# Altium schematic sheet Test.SchDoc
size A2; PageSetup: Record=PageOptions|CenterHorizontal=True|CenterVertical=True|PrintScale=0.68|XCorrection=1.00|YCorrection=1.00|PrintKind=1|BorderSize=5000000|LeftOffset=0|BottomOffset=0|Orientation=2|PaperLength=1000|PaperWidth=1000|Scale=100|PaperSource=7|PrintQuality=-4|MediaType=1|DitherType=10|PrintScaleMode=1|PaperKind=A3
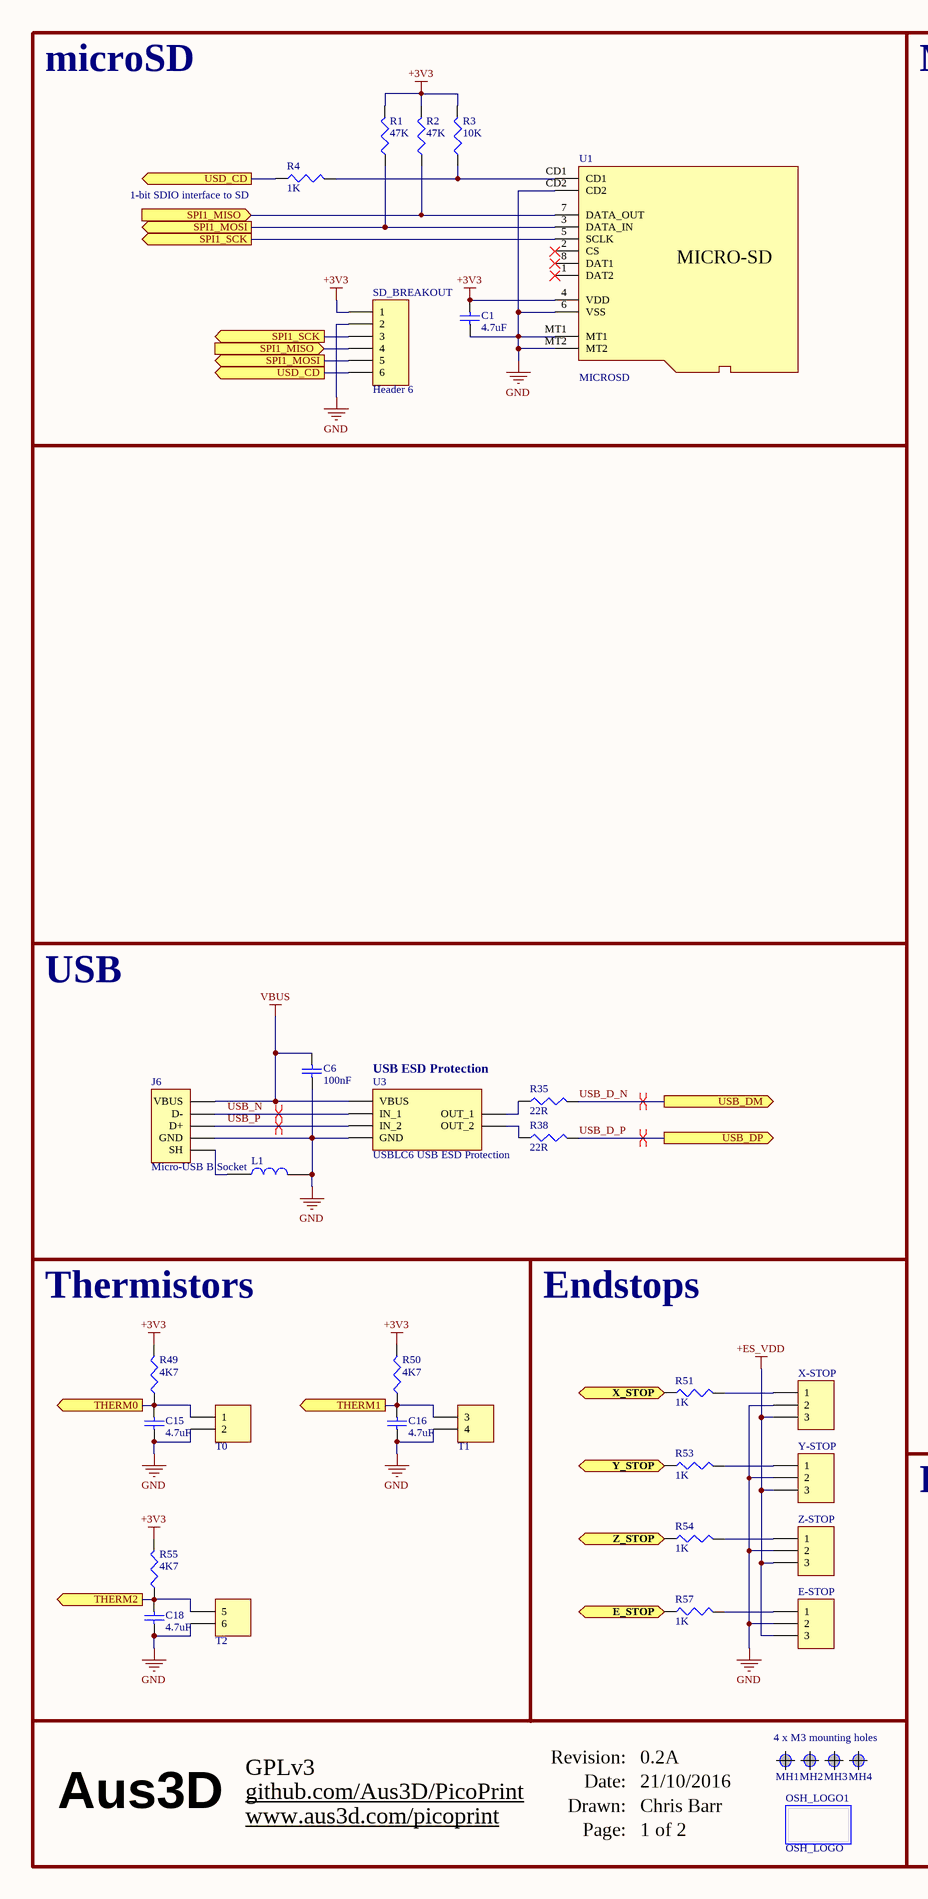
[diagram p0: Test.SchDoc, left]
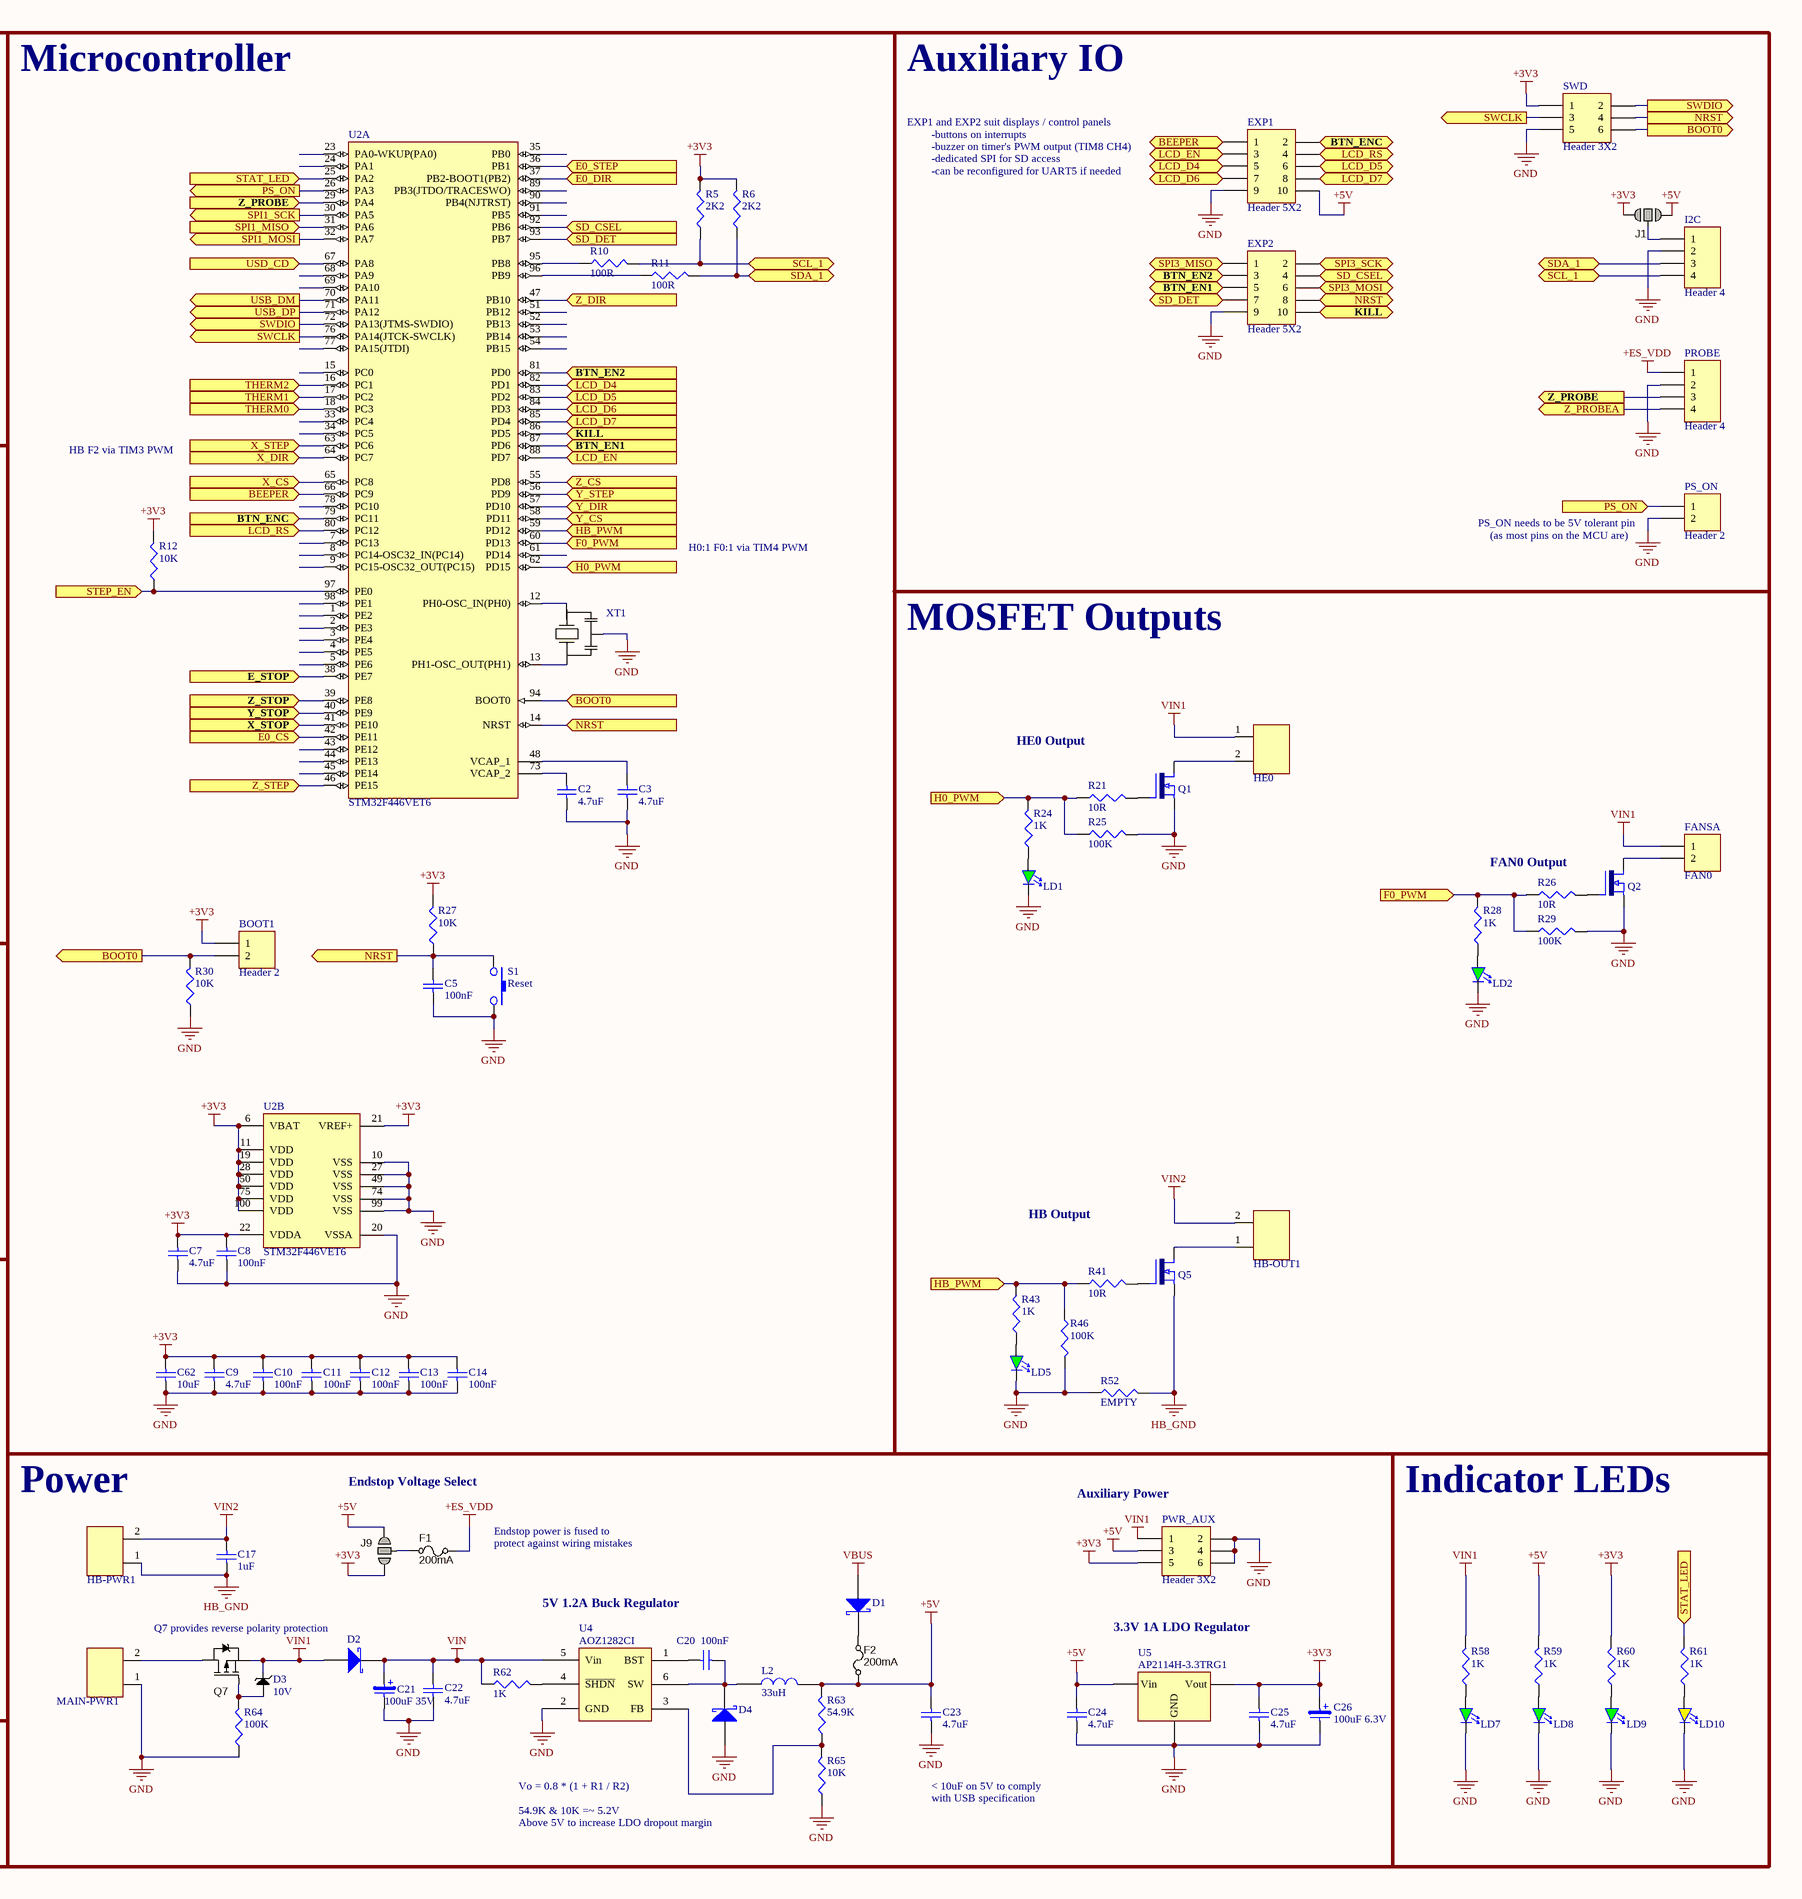
[diagram p1: Test.SchDoc, right]

## Parts
BOOT1  Header 2  [HDR1X2-HEADER]
C1  value 4.7uF  [CAP 1005-0402]  (hidden comment: CapC-0402-4.7uF-10V)
C2  value 4.7uF  [CAP 1005-0402]  (hidden comment: CapC-0402-4.7uF-10V)
C3  value 4.7uF  [CAP 1005-0402]  (hidden comment: CapC-0402-4.7uF-10V)
C5  value 100nF  [CAP 1005-0402]  (hidden comment: CapC-0402-100nF)
C6  value 100nF  [CAP 1005-0402]  (hidden comment: CapC-0402-100nF)
C7  value 4.7uF  [CAP 1005-0402]  (hidden comment: CapC-0402-4.7uF-10V)
C8  value 100nF  [CAP 1005-0402]  (hidden comment: CapC-0402-100nF)
C9  value 4.7uF  [CAP 1005-0402]  (hidden comment: CapC-0402-4.7uF-10V)
C10  value 100nF  [CAP 1005-0402]  (hidden comment: CapC-0402-100nF)
C11  value 100nF  [CAP 1005-0402]  (hidden comment: CapC-0402-100nF)
C12  value 100nF  [CAP 1005-0402]  (hidden comment: CapC-0402-100nF)
C13  value 100nF  [CAP 1005-0402]  (hidden comment: CapC-0402-100nF)
C14  value 100nF  [CAP 1005-0402]  (hidden comment: CapC-0402-100nF)
C15  value 4.7uF  [CAP 1005-0402]  (hidden comment: CapC-0402-4.7uF-10V)
C16  value 4.7uF  [CAP 1005-0402]  (hidden comment: CapC-0402-4.7uF-10V)
C17  value 1uF  [Cap 1608-0603]  (hidden comment: CapC-0603-1uF 50V)
C18  value 4.7uF  [CAP 1005-0402]  (hidden comment: CapC-0402-4.7uF-10V)
C20  value 100nF  [CAP 1005-0402]  (hidden comment: CapC-0402-100nF)
C21  value 100uF 35V  [CAP EL PANASONIC]  (hidden comment: CapE-6.3-100uF-35V)
C22  value 4.7uF  [CAP 3225-1210]  (hidden comment: CapC-1210-4.7uF-50V)
C23  value 4.7uF  [CAPC2012X135N]  (hidden comment: CapC-0805-4.7uF 10V)
C24  value 4.7uF  [CAPC2012X135N]  (hidden comment: CapC-0805-4.7uF 10V)
C25  value 4.7uF  [CAP 1005-0402]  (hidden comment: CapC-0402-4.7uF-10V)
C26  value 100uF 6.3V  [CAP EL 5mm]  (hidden comment: CapE-5.0-100uF-6.3V)
C62  value 10uF  [CAPC2012X135N]  (hidden comment: CapC-0805-10uF 6.3V)
D1  Diode Schottky 700mA 20V  [SC-85]  (value not drawn)
D2  Diode Schottky 2A 40V  [DIOM2616X08N]  (value not drawn)
D3  Voltage: 10V  [SOD523]  (hidden comment: Diode Zener 10V)
D4  Diode Schottky 2A 40V  [DIOM2616X08N]  (value not drawn)
E-STOP  Header 3  [HDR1X3-HEADER]  (value not drawn)
EXP1  Header 5X2  [HDR2X5_exp Iner only\]
EXP2  Header 5X2  [HDR2X5_exp Iner only\]
F1  value 200mA  [PTC Fuse1608-0603]  (hidden comment: PTC Resettable Fuse)
F2  value 200mA  [PTC Fuse1608-0603]  (hidden comment: PTC Resettable Fuse)
FANS  FAN0  [HDR2X3-Header]  (part A of 3)
HB-OUT1  Screw Terminal 5mm 2-Way  [TERM2 5MM]  (value not drawn)
HB-PWR1  Screw Terminal 5mm 2-Way  [TERM2 5MM]  (value not drawn)
HE0  Screw Terminal 3.5mm 2-Way  [TERM2 3.5mm]  (value not drawn)
I2C  Header 4  [HDR1X4-HEADER]
J1  Jumper  [JUMPER-3-NO]  (value not drawn)  (no BOM)
J6  Micro-USB B Socket  [Micro-USB B Molex 105017-0001]
J9  Jumper  [JUMPER-3-NO]  (value not drawn)  (no BOM)
L1  Ferrite Bead SMD 0805  [Res 2012-0805]  (value not drawn)
L2  value 33uH  [SRN6045TA SMD Inductor]  (hidden comment: Inductor SMD 33uH 2.5A)
LD1  GREEN  [LED 1608-0603]  (value not drawn)
LD2  GREEN  [LED 1608-0603]  (value not drawn)
LD5  GREEN  [LED 1608-0603]  (value not drawn)
LD7  GREEN  [LED 1608-0603]  (value not drawn)
LD8  GREEN  [LED 1608-0603]  (value not drawn)
LD9  GREEN  [LED 1608-0603]  (value not drawn)
LD10  YELLOW  [LED 1608-0603]  (value not drawn)
MAIN-PWR1  Screw Terminal 5mm 2-Way  [TERM2 5MM]  (value not drawn)
MH1  Screw Hole  [M3-Hole-2]  (value not drawn)  (no BOM)
MH2  Screw Hole  [M3-Hole-2]  (value not drawn)  (no BOM)
MH3  Screw Hole  [M3-Hole-2]  (value not drawn)  (no BOM)
MH4  Screw Hole  [M3-Hole-2]  (value not drawn)  (no BOM)
OSH_LOGO1  OSH_LOGO  [OSHW-LOGO-L]  (no BOM)
PROBE  Header 4  [HDR1X4-HEADER]
PS_ON  Header 2  [HDR1X2-HEADER]
PWR_AUX  Header 3X2  [HDR2X3-Header]
Q1  MOSFET - AO3400A  [SOT23-3 New]  (value not drawn)
Q2  MOSFET - AO3400A  [SOT23-3 New]  (value not drawn)
Q5  PSMN1R8-40YLC  [LFPACK]  (value not drawn)
Q7  SIA453EDJ-T1-GE3  [PowerPAK SC-70]  (value not drawn)
R1  value 47K  [RESC1005X40N]  (hidden comment: Res-0402-47K)
R2  value 47K  [RESC1005X40N]  (hidden comment: Res-0402-47K)
R3  value 10K  [RESC1005X40N]  (hidden comment: Res-0402-10K)
R4  value 1K  [RESC1005X40N]  (hidden comment: Res-0402-1K)
R5  value 2K2  [RESC1005X40N]  (hidden comment: Res-0402-2K2)
R6  value 2K2  [RESC1005X40N]  (hidden comment: Res-0402-2K2)
R10  value 100R  [RESC1005X40N]  (hidden comment: Res-0402-100R)
R11  value 100R  [RESC1005X40N]  (hidden comment: Res-0402-100R)
R12  value 10K  [RESC1005X40N]  (hidden comment: Res-0402-10K)
R21  value 10R  [RESC1005X40N]  (hidden comment: Res-0402-10R)
R24  value 1K  [RESC1005X40N]  (hidden comment: Res-0402-1K)
R25  value 100K  [RESC1005X40N]  (hidden comment: Res-0402-100K)
R26  value 10R  [RESC1005X40N]  (hidden comment: Res-0402-10R)
R27  value 10K  [RESC1005X40N]  (hidden comment: Res-0402-10K)
R28  value 1K  [RESC1005X40N]  (hidden comment: Res-0402-1K)
R29  value 100K  [RESC1005X40N]  (hidden comment: Res-0402-100K)
R30  value 10K  [RESC1005X40N]  (hidden comment: Res-0402-10K)
R35  value 22R  [RESC1005X40N]  (hidden comment: Res-0402-22R)
R38  value 22R  [RESC1005X40N]  (hidden comment: Res-0402-22R)
R41  value 10R  [RESC1005X40N]  (hidden comment: Res-0402-10R)
R43  value 1K  [RESC1005X40N]  (hidden comment: Res-0402-1K)
R46  value 100K  [RESC1005X40N]  (hidden comment: Res-0402-100K)
R49  value 4K7  [RESC1005X40N]  (hidden comment: Res-0402-4K7)
R50  value 4K7  [RESC1005X40N]  (hidden comment: Res-0402-4K7)
R51  value 1K  [RESC1005X40N]  (hidden comment: Res-0402-1K)
R52  value EMPTY  [RESC1005X40N]  (hidden comment: Res-0402-EMPTY)  (no BOM)
R53  value 1K  [RESC1005X40N]  (hidden comment: Res-0402-1K)
R54  value 1K  [RESC1005X40N]  (hidden comment: Res-0402-1K)
R55  value 4K7  [RESC1005X40N]  (hidden comment: Res-0402-4K7)
R57  value 1K  [RESC1005X40N]  (hidden comment: Res-0402-1K)
R58  value 1K  [RESC1005X40N]  (hidden comment: Res-0402-1K)
R59  value 1K  [RESC1005X40N]  (hidden comment: Res-0402-1K)
R60  value 1K  [RESC1005X40N]  (hidden comment: Res-0402-1K)
R61  value 1K  [RESC1005X40N]  (hidden comment: Res-0402-1K)
R62  value 1K  [RESC1005X40N]  (hidden comment: Res-0402-1K)
R63  value 54.9K  [RESC1005X40N]  (hidden comment: Res-0402-54.9K)
R64  value 100K  [RESC1005X40N]  (hidden comment: Res-0402-100K)
R65  value 10K  [RESC1005X40N]  (hidden comment: Res-0402-10K)
S1  Reset  [SW-PB SMD 2pin]
SD_BREAKOUT  Header 6  [HDR1X6-HEADER]
SWD  Header 3X2  [HDR2X3-Header]
THERM_HEADER  T0  [HDR1X8-HEADER]  (parts A,B,C of 4)
U1  MICROSD  [MICRO-SD]
U2  STM32F446VET6  [STM-LQFP100_N]  (parts A,B of 2)
U3  USBLC6 USB ESD Protection  [SOT23-6N]
U4  AOZ1282CI  [SOT23-6N]
U5  AP2114H-3.3TRG1  [SOT229P700X180-4N]
X-STOP  Header 3  [HDR1X3-HEADER]  (value not drawn)
XT1  Ceramic Resonator CSTCE12M0G55-R0  [CERALOCK CSTCE_G]  (value not drawn)
Y-STOP  Header 3  [HDR1X3-HEADER]  (value not drawn)
Z-STOP  Header 3  [HDR1X3-HEADER]  (value not drawn)

## Blocks framed on the sheet
microSD: C1 R1-R4 SD_BREAKOUT U1
Microcontroller: BOOT1 C2 C3 C5 C7-C14 C62 R5 R6 R10-R12 R27 R30 S1 U2 XT1
Auxiliary IO: EXP1 EXP2 I2C J1 PROBE PS_ON SWD
MOSFET Outputs: FANS HB-OUT1 HE0 LD1 LD2 LD5 Q1 Q2 Q5 R21 R24-R26 R28 R29 R41 R43 R46 R52
USB: C6 J6 L1 R35 R38 U3
Thermistors: C15 C16 C18 R49 R50 R55 THERM_HEADER
Endstops: E-STOP R51 R53 R54 R57 X-STOP Y-STOP Z-STOP
Power: C17 C20-C26 D1-D4 F1 F2 HB-PWR1 J9 L2 MAIN-PWR1 PWR_AUX Q7 R62-R65 U4 U5
Indicator LEDs: LD7-LD10 R58-R61
Aus3D: MH1-MH4 OSH_LOGO1

## Ports
BEEPER (in), BOOT0 (in), BOOT0 (out), BTN_EN1 (in), BTN_EN1 (out), BTN_EN2 (in), BTN_EN2 (out), BTN_ENC (in), BTN_ENC (out), E0_CS (in), E0_DIR (in), E0_STEP (in), E_STOP (in), E_STOP (out), F0_PWM (in), H0_PWM (in), HB_PWM (in), KILL (in), KILL (out), LCD_D4 (in), LCD_D5 (in), LCD_D6 (in), LCD_D7 (in), LCD_EN (in), LCD_RS (in), NRST (in), NRST (out), PS_ON (in), PS_ON (out), SCL_1 (bidir), SD_CSEL (in), SD_DET (in), SD_DET (out), SDA_1 (bidir), SPI1_MISO (in), SPI1_MOSI (out), SPI1_SCK (out), SPI3_MISO (in), SPI3_MOSI (in), SPI3_SCK (in), STAT_LED (in), STEP_EN (in), SWCLK (out), SWDIO (out), THERM0 (in), THERM0 (out), THERM1 (in), THERM1 (out), THERM2 (in), THERM2 (out), USB_DM (out), USB_DP (out), USD_CD (in), USD_CD (out), X_CS (in), X_DIR (in), X_STEP (in), X_STOP (in), X_STOP (out), Y_CS (in), Y_DIR (in), Y_STEP (in), Y_STOP (in), Y_STOP (out), Z_CS (in), Z_DIR (in), Z_PROBE (in), Z_PROBE (out), Z_PROBEA (out), Z_STEP (in), Z_STOP (in), Z_STOP (out)

## Nets
+3V3: BOOT1.1 C1.2 C7.2 C8.2 C9.2 C10.2 C11.2 C12.2 C13.2 C14.2 C25.2 C26.1 C62.2 J1.1 J9.1 PWR_AUX.5 R1.2 R2.2 R3.2 R5.2 R6.2 R12.2 R27.2 R49.2 R50.2 R55.2 R60.2 SD_BREAKOUT.1 SWD.1 U1.4(VDD) U2.6(VBAT) U2.11(VDD) U2.19(VDD) U2.21(VREF+) U2.22(VDDA) U2.28(VDD) U2.50(VDD) U2.75(VDD) U2.100(VDD) U5.Vout
+5V: C23.2 C24.2 EXP1.10 F2.1 J1.3 J9.3 L2.2 PWR_AUX.3 R59.2 R63.2 U5.Vin
+ES_VDD: E-STOP.3 F1.2 PROBE.1 X-STOP.3 Y-STOP.3 Z-STOP.3
GND: C1.1 C2.1 C3.1 C5.1 C6.1 C7.1 C8.1 C9.1 C10.1 C11.1 C12.1 C13.1 C14.1 C15.1 C16.1 C18.1 C21.2 C22.1 C23.1 C24.1 C25.1 C26.2 C62.1 D4.A E-STOP.2 EXP1.9 EXP2.9 I2C.2 J6.GND L1.2 LD1.2(K) LD2.2(K) LD5.2(K) LD7.2(K) LD8.2(K) LD9.2(K) LD10.2(K) MAIN-PWR1.1 PROBE.2 PS_ON.2 PWR_AUX.2 PWR_AUX.4 PWR_AUX.6 Q1.2(S) Q2.2(S) R25.2 R29.2 R30.1 R46.2 R52.1 R64.1 R65.1 S1.2 SD_BREAKOUT.2 SWD.5 THERM_HEADER.2 THERM_HEADER.4 THERM_HEADER.6 U1.6(VSS) U1.CD2 U1.MT1 U1.MT2 U2.10(VSS) U2.20(VSSA) U2.27(VSS) U2.49(VSS) U2.74(VSS) U2.99(VSS) U3.2(GND) U4.2(GND) U5.GND X-STOP.2 XT1.2(GND) Y-STOP.2 Z-STOP.2
HB_GND: C17.1 HB-PWR1.1 Q5.3(S) R52.2
VBUS: C6.2 D1.1(A) J6.VBUS U3.5(VBUS)
VIN: C21.1 C22.2 D2.K R62.1 U4.5(Vin)
VIN1: D2.A D3.K FANS.1 HE0.1 PWR_AUX.1 Q7.4(S) R58.2
VIN2: C17.2 HB-OUT1.2 HB-PWR1.2
BEEPER: EXP1.1 U2.66(PC9) ; port BEEPER
BOOT0: BOOT1.2 R30.2 SWD.6 U2.94(BOOT0) ; port BOOT0
BTN_EN1: EXP2.5 U2.87(PD6) ; port BTN_EN1
BTN_EN2: EXP2.3 U2.81(PD0) ; port BTN_EN2
BTN_ENC: EXP1.2 U2.79(PC11) ; port BTN_ENC
E0_CS: U2.42(PE11) ; port E0_CS
E0_DIR: U2.37(PB2-BOOT1(PB2)) ; port E0_DIR
E0_STEP: U2.36(PB1) ; port E0_STEP
E_STOP: R57.1 U2.38(PE7) ; port E_STOP
F0_PWM: R26.1 R28.2 R29.1 U2.60(PD13) ; port F0_PWM
H0_PWM: R21.1 R24.2 R25.1 U2.62(PD15) ; port H0_PWM
HB_PWM: R41.1 R43.2 R46.1 U2.59(PD12) ; port HB_PWM
KILL: EXP2.10 U2.86(PD5) ; port KILL
LCD_D4: EXP1.5 U2.82(PD1) ; port LCD_D4
LCD_D5: EXP1.6 U2.83(PD2) ; port LCD_D5
LCD_D6: EXP1.7 U2.84(PD3) ; port LCD_D6
LCD_D7: EXP1.8 U2.85(PD4) ; port LCD_D7
LCD_EN: EXP1.3 U2.88(PD7) ; port LCD_EN
LCD_RS: EXP1.4 U2.80(PC12) ; port LCD_RS
NRST: C5.2 EXP2.8 R27.1 S1.1 SWD.4 U2.14(NRST) ; port NRST
PS_ON: PS_ON.1 U2.26(PA3) ; port PS_ON
SCL_1: I2C.4 R5.1 R10.2 ; port SCL_1
SD_CSEL: EXP2.4 U2.92(PB6) ; port SD_CSEL
SD_DET: EXP2.7 U2.93(PB7) ; port SD_DET
SDA_1: I2C.3 R6.1 R11.2 ; port SDA_1
SPI1_MISO: R2.1 SD_BREAKOUT.4 U1.7(DATA_OUT) U2.31(PA6) ; port SPI1_MISO
SPI1_MOSI: R1.1 SD_BREAKOUT.5 U1.3(DATA_IN) U2.32(PA7) ; port SPI1_MOSI
SPI1_SCK: SD_BREAKOUT.3 U1.5(SCLK) U2.30(PA5) ; port SPI1_SCK
SPI3_MISO: EXP2.1 ; port SPI3_MISO
SPI3_MOSI: EXP2.6 ; port SPI3_MOSI
SPI3_SCK: EXP2.2 ; port SPI3_SCK
STAT_LED: R61.2 U2.25(PA2) ; port STAT_LED
STEP_EN: R12.1 U2.97(PE0) ; port STEP_EN
SWCLK: SWD.3 U2.76(PA14(JTCK-SWCLK)) ; port SWCLK
SWDIO: SWD.2 U2.72(PA13(JTMS-SWDIO)) ; port SWDIO
THERM0: C15.2 R49.1 THERM_HEADER.1 U2.18(PC3) ; port THERM0
THERM1: C16.2 R50.1 THERM_HEADER.3 U2.17(PC2) ; port THERM1
THERM2: C18.2 R55.1 THERM_HEADER.5 U2.16(PC1) ; port THERM2
USB_D_N: R35.2 U2.70(PA11) ; port USB_DM
USB_D_P: R38.2 U2.71(PA12) ; port USB_DP
USB_N: J6.D- U3.1(IN_1)
USB_P: J6.D+ U3.3(IN_2)
USD_CD: R4.1 SD_BREAKOUT.6 U2.67(PA8) ; port USD_CD
X_CS: U2.65(PC8) ; port X_CS
X_DIR: U2.64(PC7) ; port X_DIR
X_STEP: U2.63(PC6) ; port X_STEP
X_STOP: R51.1 U2.41(PE10) ; port X_STOP
Y_CS: U2.58(PD11) ; port Y_CS
Y_DIR: U2.57(PD10) ; port Y_DIR
Y_STEP: U2.56(PD9) ; port Y_STEP
Y_STOP: R53.1 U2.40(PE9) ; port Y_STOP
Z_CS: U2.55(PD8) ; port Z_CS
Z_DIR: U2.47(PB10) ; port Z_DIR
Z_PROBE: PROBE.3 U2.29(PA4) ; port Z_PROBE
Z_PROBEA: PROBE.4 ; port Z_PROBEA
Z_STEP: U2.46(PE15) ; port Z_STEP
Z_STOP: R54.1 U2.39(PE8) ; port Z_STOP
NetC2_2: C2.2 U2.73(VCAP_2)
NetC3_2: C3.2 U2.48(VCAP_1)
NetC20_1: C20.1 D4.K L2.1 U4.6(SW)
NetC20_2: C20.2 U4.1(BST)
NetD1_3: D1.3(K) F2.2
NetD3_A: D3.A Q7.3(G) R64.2
NetE-STOP_1: E-STOP.1 R57.2
NetF1_1: F1.1 J9.2
NetFANS_2: FANS.2 Q2.3(D)
NetHB-OUT1_1: HB-OUT1.1 Q5.2(D)
NetHE0_2: HE0.2 Q1.3(D)
NetI2C_1: I2C.1 J1.2
NetJ6_SHIELD: J6.SHIELD(SH) L1.1
NetLD1_1: LD1.1(A) R24.1
NetLD2_1: LD2.1(A) R28.1
NetLD5_1: LD5.1(A) R43.1
NetLD7_1: LD7.1(A) R58.1
NetLD8_1: LD8.1(A) R59.1
NetLD9_1: LD9.1(A) R60.1
NetLD10_1: LD10.1(A) R61.1
NetMAIN-PWR1_2: MAIN-PWR1.2 Q7.1(D)
NetQ1_1: Q1.1(G) R21.2
NetQ2_1: Q2.1(G) R26.2
NetQ5_1: Q5.1(G) R41.2
NetR3_1: R3.1 R4.2 U1.CD1
NetR10_1: R10.1 U2.95(PB8)
NetR11_1: R11.1 U2.96(PB9)
NetR35_1: R35.1 U3.6(OUT_1)
NetR38_1: R38.1 U3.4(OUT_2)
NetR51_2: R51.2 X-STOP.1
NetR53_2: R53.2 Y-STOP.1
NetR54_2: R54.2 Z-STOP.1
NetR62_2: R62.2 U4.4(~{SHDN})
NetR63_1: R63.1 R65.2 U4.3(FB)
NetU2_12: U2.12(PH0-OSC_IN(PH0)) XT1.3(OUT)
NetU2_13: U2.13(PH1-OSC_OUT(PH1)) XT1.1(IN)

Not connected (* = marked no-connect by the designer): MH1 M3(0); MH2 M3(0); MH3 M3(0); MH4 M3(0); U1 1(DAT2)* 2(CS)* 8(DAT1)*; U2 1(PE2) 2(PE3) 3(PE4) 4(PE5) 5(PE6) 7(PC13) 8(PC14-OSC32_IN(PC14)) 9(PC15-OSC32_OUT(PC15)) 15(PC0) 23(PA0-WKUP(PA0)) 24(PA1) 33(PC4) 34(PC5) 35(PB0) 43(PE12) 44(PE13) 45(PE14) 51(PB12) 52(PB13) 53(PB14) 54(PB15) 61(PD14) 68(PA9) 69(PA10) 77(PA15(JTDI)) 78(PC10) 89(PB3(JTDO/TRACESWO)) 90(PB4(NJTRST)) 91(PB5) 98(PE1)

## Layout directives
differential pair: USB_D_N, USB_D_P, USB_N, USB_P

## Notes on the sheet
- EXP1 and EXP2 suit displays / control panels
- -buttons on interrupts
- -buzzer on timer's PWM output (TIM8 CH4)
- -dedicated SPI for SD access
- (near R4) 1-bit SDIO interface to SD
- -can be reconfigured for UART5 if needed
- HB F2 via TIM3 PWM
- (near PS_ON) PS_ON needs to be 5V tolerant pin
- H0:1 F0:1 via TIM4 PWM
- (near PS_ON) (as most pins on the MCU are)
- HE0 Output
- FAN0 Output
- (near U3) USB ESD Protection
- HB Output
- Endstop Voltage Select
- (near PWR_AUX) Auxiliary Power
- (near F1) Endstop power is fused to
- (near F1) protect against wiring mistakes
- 5V 1.2A Buck Regulator
- Q7 provides reverse polarity protection
- 3.3V 1A LDO Regulator
- 4 x M3 mounting holes
- github.com/Aus3D/PicoPrint
- GPLv3
- Date:
- Revision:
- 0.2A
- 21/10/2016
- Vo = 0.8 * (1 + R1 / R2)
- < 10uF on 5V to comply
- with USB specification
- www.aus3d.com/picoprint
- Drawn:
- Page:
- Chris Barr
- 1 of 2
- 54.9K & 10K =~ 5.2V
- Above 5V to increase LDO dropout margin
- (in symbol MICROSD) MICRO-SD

## Library data of the parts
BOOT1 PS_ON = Header 2: Header, 2-Pin; Note: Approved sub OK; LatestRevisionDate: 17-Jul-2002; LatestRevisionNote: Re-released for DXP Platform.; Publisher: Altium Limited; Supplier 1: Digi-Key; Supplier Part Number 1: 3M9447-ND
C1-C3 C7 C9 C15 C16 C18 C25 = CapC-0402-4.7uF-10V: Capacitor (Semiconductor SIM Model); Voltage: 10V; Note: Approved sub OK; Published: 8-Jun-2000; Revision: July-2002: Re-released for DXP Platform.; Publisher: Altium Limited; Supplier 1: Digi-Key; Supplier Part Number 1: 1276-1482-1-ND
C5 C6 C8 C10-C14 C20 = CapC-0402-100nF: Capacitor (Semiconductor SIM Model); Note: Approved sub OK; Published: 8-Jun-2000; Revision: July-2002: Re-released for DXP Platform.; Publisher: Altium Limited; Supplier 1: Digi-Key; Supplier Part Number 1: 311-1336-1-ND
C17 = CapC-0603-1uF 50V: Capacitor (Semiconductor SIM Model); Note: Approved sub OK; Published: 8-Jun-2000; Revision: July-2002: Re-released for DXP Platform.; Publisher: Altium Limited; Supplier 1: Digi-Key; Supplier Part Number 1: 1276-1860-1-ND
C21 = CapE-6.3-100uF-35V: Polarized Capacitor (Surface Mount); Note: Approved sub OK; Published: 8-Jun-2000; Revision: July-2002: Re-released for DXP Platform.; Publisher: Altium Limited; Supplier 1: Digi-Key; Supplier Part Number 1: PCE5016CT-ND
C22 = CapC-1210-4.7uF-50V: Capacitor (Semiconductor SIM Model); Note: Approved sub OK; Published: 8-Jun-2000; Revision: July-2002: Re-released for DXP Platform.; Publisher: Altium Limited; Supplier 1: Digi-Key; Supplier Part Number 1: 490-1864-1-ND
C23 C24 = CapC-0805-4.7uF 10V: Capacitor (Semiconductor SIM Model); Note: Approved sub OK; Published: 8-Jun-2000; Revision: July-2002: Re-released for DXP Platform.; Publisher: Altium Limited; Supplier 1: Digi-Key; Supplier Part Number 1: 1276-1244-1-ND
C26 = CapE-5.0-100uF-6.3V: Polarized Capacitor (Surface Mount); Note: Approved sub OK; Published: 8-Jun-2000; Revision: July-2002: Re-released for DXP Platform.; Publisher: Altium Limited; Supplier 1: Digi-Key; Supplier Part Number 1: 565-2057-1-ND
C62 = CapC-0805-10uF 6.3V: Capacitor (Semiconductor SIM Model); Note: Approved sub OK; Published: 8-Jun-2000; Revision: July-2002: Re-released for DXP Platform.; Publisher: Altium Limited; Supplier 1: Digi-Key; Supplier Part Number 1: 1276-6457-1-ND
D1 = Diode Schottky 700mA 20V: Default Diode; Note: Approved sub OK; Revision: July-2002: Re-released for DXP Platform.; Supplier 1: Digi-Key; Supplier Part Number 1: DB3J208K0LCT-ND
D2 D4 = Diode Schottky 2A 40V: Default Diode; Code - JEDEC: DO-214-AB; Note: Approved sub OK; Published: 8-Jun-2000; Revision: July-2002: Re-released for DXP Platform.; Publisher: Altium Limited; Supplier 1: Digi-Key; Supplier Part Number 1: DB2W40200LCT-ND
D3 = Diode Zener 10V: Default Diode; Code - JEDEC: DO-214-AB; Note: Approved sub OK; Published: 8-Jun-2000; Revision: July-2002: Re-released for DXP Platform.; Publisher: Altium Limited; Supplier 1: Digi-Key; Supplier Part Number 1: DZ2S100M0LCT-ND
E-STOP X-STOP Y-STOP Z-STOP = Header 3: Header, 3-Pin; Note: Approved sub OK; LatestRevisionDate: 17-Jul-2002; LatestRevisionNote: Re-released for DXP Platform.; Publisher: Altium Limited; Supplier 1: Digi-Key; Supplier Part Number 1: 3M9448-ND
EXP1 EXP2 = Header 5X2: Header, 5-Pin, Dual row; Note: Approved sub OK; LatestRevisionDate: 17-Jul-2002; LatestRevisionNote: Re-released for DXP Platform.; Publisher: Altium Limited; Supplier 1: Digi-Key; Supplier Part Number 1: 3M9460-ND
F1 F2 = Fuse - 15V 200mA Trip PTC SMD 0603: Manufacturer 1: Holly Fuse; Manufacturer Part Number 1: 06T-0160L; Ratings: 160mA; 63VDC; slow-blow; SCDType: spec; Package / Case: 0603 (1608 metric); Supplier 1: Digi-Key; Supplier Part Number 1: 507-1821-1-ND
FANS = Header 3x2_MULTI: Header, 6-Pin; Note: Approved sub OK; LatestRevisionDate: 17-Jul-2002; LatestRevisionNote: Re-released for DXP Platform.; Publisher: Altium Limited; Supplier 1: Digi-Key; Supplier Part Number 1: 3M9459-ND
HB-OUT1 HB-PWR1 MAIN-PWR1 = ScrewTerminal-5mm-2Way: Note: Approved sub OK; Supplier 1: Digi-Key; Supplier Part Number 1: 277-6405-ND
HE0 = ScrewTerminal-3.5mm-2Way: Note: Approved sub OK; Supplier 1: Digi-Key; Supplier Part Number 1: 277-5719-ND
I2C PROBE = Header 4: Header, 4-Pin; Note: Approved sub OK; LatestRevisionDate: 17-Jul-2002; LatestRevisionNote: Re-released for DXP Platform.; Publisher: Altium Limited; Supplier 1: Digi-Key; Supplier Part Number 1: 3M9449-ND
J1 J9 = JUMP3-NO: SMD jumper
J6 = Micro-USB B Socket: Note: Approved sub OK; Supplier 1: Digi-Key; Supplier Part Number 1: WM1399CT-ND
L1 = Ferrite Bead SMD 0805: MagneticCore Inductor with Winding Polarity Marking; Value: WE-CBF_0805 (WE-CBF); Note: Approved sub OK; Published: 24-Mar-1999; Revision: July-2002: Re-released for DXP Platform.; Publisher: Altium Limited; Supplier 1: Digi-Key; Supplier Part Number 1: 490-1054-1-ND
L2 = Inductor SMD 33uH 2.5A: MagneticCore Inductor with Winding Polarity Marking; Published: 24-Mar-1999; Revision: July-2002: Re-released for DXP Platform.; Publisher: Altium Limited; Supplier 1: Digi-Key; Supplier Part Number 1: SRN6045TA-330MCT-ND
LD1 LD2 LD5 LD7-LD9 = LEDG  0603: Hyper-Bright LED; Note: Approved sub OK; Supplier 1: Digi-Key; Supplier Part Number 1: 160-1435-2-ND
LD10 = LEDY  0603: Hyper-Bright LED; Note: Approved sub OK; Supplier 1: Digi-Key; Supplier Part Number 1: 160-1437-1-ND
PWR_AUX SWD = Header 3X2: Header, 3-Pin, Dual row; Note: Approved sub OK; LatestRevisionDate: 17-Jul-2002; LatestRevisionNote: Re-released for DXP Platform.; Publisher: Altium Limited; Supplier 1: Digi-Key; Supplier Part Number 1: 3M9459-ND
Q1 Q2 = MOSFET - AO3400A: N-CH MOSFET 30V 5.7A SOT23; Supplier 1: Digi-Key; Supplier Part Number 1: 785-1000-1-ND
Q5 = MOSFET - PSMN1R8-40YLC: N-CH MOSFET 40V 100A LFPAK; Supplier 1: Digi-Key; Supplier Part Number 1: 568-10156-1-ND
Q7 = MOSFET - SIA453EDJ-T1-GE3: MOSFET SMD P-CH 30V 24A PowerPAK SC-70-6; Manufacturer 1: Fairchild Semiconductor; Manufacturer Part Number 1: BSS84; FET Type: MOSFET P-Channel, Metal Oxide; FET Feature: Logic Level Gate; Drain to Source Voltage (Vdss): 50V; Current - Continuous Drain (Id) @ 25° C: 130mA; Gate Charge (Qg) @ Vgs: 1.3nC @ 5V; Input Capacitance (Ciss) @ Vds: 73pF @ 25V; ComponentLink1URL: http://www.fairchildsemi.com/ds/BS/BSS84.pdf; ComponentLink1Description: http://www.fairchildsemi.com/ds/BS/BSS84.pdf; Supplier 1: Digi-Key; Supplier Part Number 1: SIA453EDJ-T1-GE3CT-ND
R1 R2 = Res-0402-47K: Resistor; Note: Approved sub OK; Published: 8-Jun-2000; Revision: July-2002: Re-released for DXP Platform.; Publisher: Altium Limited; Supplier 1: Digi-Key; Supplier Part Number 1: 311-47KJRCT-ND
R3 R12 R27 R30 R65 = Res-0402-10K: Resistor; Note: Approved sub OK; Published: 8-Jun-2000; Revision: July-2002: Re-released for DXP Platform.; Publisher: Altium Limited; Supplier 1: Digi-Key; Supplier Part Number 1: 311-10KJRCT-ND
R4 R24 R28 R43 R51 R53 R54 R57-R62 = Res-0402-1K: Resistor; Note: Approved sub OK; Published: 8-Jun-2000; Revision: July-2002: Re-released for DXP Platform.; Publisher: Altium Limited; Supplier 1: Digi-Key; Supplier Part Number 1: 311-1.0KJRCT-ND
R5 R6 = Res-0402-2K2: Resistor; Note: Approved sub OK; Published: 8-Jun-2000; Revision: July-2002: Re-released for DXP Platform.; Publisher: Altium Limited; Supplier 1: Digi-Key; Supplier Part Number 1: 311-2.2KJRCT-ND
R10 R11 = Res-0402-100R: Resistor; Note: Approved sub OK; Published: 8-Jun-2000; Revision: July-2002: Re-released for DXP Platform.; Publisher: Altium Limited; Supplier 1: Digi-Key; Supplier Part Number 1: 311-100JRCT-ND
R21 R26 R41 = Res-0402-10R: Resistor; Note: Approved sub OK; Published: 8-Jun-2000; Revision: July-2002: Re-released for DXP Platform.; Publisher: Altium Limited; Supplier 1: Digi-Key; Supplier Part Number 1: 311-10JRCT-ND
R25 R29 R46 R64 = Res-0402-100K: Resistor; Note: Approved sub OK; Published: 8-Jun-2000; Revision: July-2002: Re-released for DXP Platform.; Publisher: Altium Limited; Supplier 1: Digi-Key; Supplier Part Number 1: 311-100KJRCT-ND
R35 R38 = Res-0402-22R: Resistor; Note: Approved sub OK; Published: 8-Jun-2000; Revision: July-2002: Re-released for DXP Platform.; Publisher: Altium Limited; Supplier 1: Digi-Key; Supplier Part Number 1: 311-22JRCT-ND
R49 R50 R55 = Res-0402-4K7: Resistor; Note: Approved sub OK; Published: 8-Jun-2000; Revision: July-2002: Re-released for DXP Platform.; Publisher: Altium Limited; Supplier 1: Digi-Key; Supplier Part Number 1: 311-4.7KJRCT-ND
R52 = Res-0402-EMPTY: Resistor; Note: Approved sub OK; Published: 8-Jun-2000; Revision: July-2002: Re-released for DXP Platform.; Publisher: Altium Limited
R63 = Res-0402-54.9K: Resistor; Note: Approved sub OK; Published: 8-Jun-2000; Revision: July-2002: Re-released for DXP Platform.; Publisher: Altium Limited; Supplier 1: Digi-Key; Supplier Part Number 1: YAG3185CT-ND
S1 = SW-PB: SMD Button; Note: Approved sub OK; Supplier 1: Digi-Key; Supplier Part Number 1: 679-2396-1-ND
SD_BREAKOUT = Header 6x1: Header, 6-Pin; Note: Approved sub OK; LatestRevisionDate: 17-Jul-2002; LatestRevisionNote: Re-released for DXP Platform.; Publisher: Altium Limited; Supplier 1: Digi-Key; Supplier Part Number 1: 3M9449-ND
THERM_HEADER = Header 8x1_MULTI: Header, 8-Pin; Note: Approved sub OK; LatestRevisionDate: 17-Jul-2002; LatestRevisionNote: Re-released for DXP Platform.; Publisher: Altium Limited; Supplier 1: Digi-Key; Supplier Part Number 1: 3M9449-ND
U1 = MICROSD: MicroSD Card Socket; Note: Approved sub OK; Supplier 1: Digi-Key; Supplier Part Number 1: 101-00660-68-6-1-ND
U2 = STM32F446VET6: ARM Cortex-M4 32-bit MCU+FPU, 210 DMIPS, 512 kB Flash, 128 kB Internal RAM, 81 I/Os, 100-pin LQFP, -40 to 105 degC, Tray; Manufacturer: STMicroelectronics; PartNumber: STM32F407VGT7; D/A Converter: 2x12-bit; FLASH Size (Prog) (kB): 1024; I/Os (High Current): 82; Internal RAM Size (kB): 192; Operating Frequency(F) (Processor speed) (MHz): 168; Supply Voltage(Vcc) max (V): 3.6; Supply Voltage(Vcc) min (V): 1.8; DatasheetVersion: Rev. 4; PackageVersion: Rev. 1, 06/2013; PackageReference: LQFP100; PackageDescription: 100-Pin Low Profile Quad Flat Package, 14 x 14 mm Body, 0.5 mm Pitch; Core: ARM Cortex-M4; Packing: Tray; Mounting Technology: Surface Mount; ComponentLink1Description: Manufacturer URL; ComponentLink1URL: http://www.st.com/web/en/home.html; ComponentLink2Description: Datasheet; ComponentLink2URL: http://www.st.com/st-web-ui/static/active/en/resource/technical/document/datasheet/DM00037051.pdf; ComponentLink3Description: Package Specification; ComponentLink3URL: http://www.st.com/st-web-ui/static/active/en/resource/technical/document/data_brief/DM00071938.pdf; Supplier 1: Digi-Key; Supplier Part Number 1: 497-15375-ND
U3 = USBLC6 USB ESD Protection: ESD Protection IC; Supplier 1: Digi-Key; Supplier Part Number 1: 497-5235-1-ND
U4 = Regulator - AOZ1282CI Buck Regulator: Buck Regulator; Supplier 1: Digi-Key; Supplier Part Number 1: 785-1613-1-ND
U5 = Regulator - AP2114 3.3V Linear Regulator: 3.3V LDO Regulator; Supplier 1: Digi-Key; Supplier Part Number 1: AP2114H-3.3TRG1DICT-ND
XT1 = Ceramic Resonator CSTCE12M0G55-R0: Ceramic Resonator; Supplier 1: Digi-Key; Supplier Part Number 1: 490-1197-1-ND